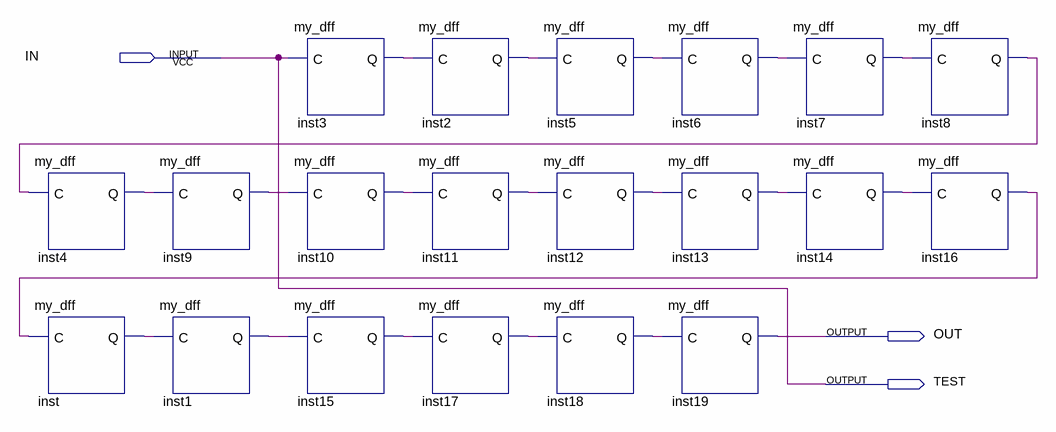
[diagram p0: schematic sheet]
// Quartus schematic VD2_20.bdf as structural Verilog: 20 symbols, 3 pins
module VD2_20 (
  input  IN,
  output OUT,
  output TEST
);

  wire inst1_q, inst2_q, inst3_q, inst4_q, inst5_q, inst6_q, inst7_q, inst8_q, inst9_q, inst10_q, inst11_q,
       inst12_q, inst13_q, inst14_q, inst15_q, inst16_q, inst17_q, inst18_q, inst_q;

  my_dff inst4 (.C(inst8_q), .Q(inst4_q));
  my_dff inst (.C(inst16_q), .Q(inst_q));
  my_dff inst9 (.C(inst4_q), .Q(inst9_q));
  my_dff inst1 (.C(inst_q), .Q(inst1_q));
  my_dff inst3 (.C(IN), .Q(inst3_q));
  my_dff inst10 (.C(inst9_q), .Q(inst10_q));
  my_dff inst15 (.C(inst1_q), .Q(inst15_q));
  my_dff inst2 (.C(inst3_q), .Q(inst2_q));
  my_dff inst11 (.C(inst10_q), .Q(inst11_q));
  my_dff inst17 (.C(inst15_q), .Q(inst17_q));
  my_dff inst5 (.C(inst2_q), .Q(inst5_q));
  my_dff inst12 (.C(inst11_q), .Q(inst12_q));
  my_dff inst18 (.C(inst17_q), .Q(inst18_q));
  my_dff inst6 (.C(inst5_q), .Q(inst6_q));
  my_dff inst13 (.C(inst12_q), .Q(inst13_q));
  my_dff inst19 (.C(inst18_q), .Q(OUT));
  my_dff inst7 (.C(inst6_q), .Q(inst7_q));
  my_dff inst14 (.C(inst13_q), .Q(inst14_q));
  my_dff inst8 (.C(inst7_q), .Q(inst8_q));
  my_dff inst16 (.C(inst14_q), .Q(inst16_q));

  assign TEST = IN;
endmodule
